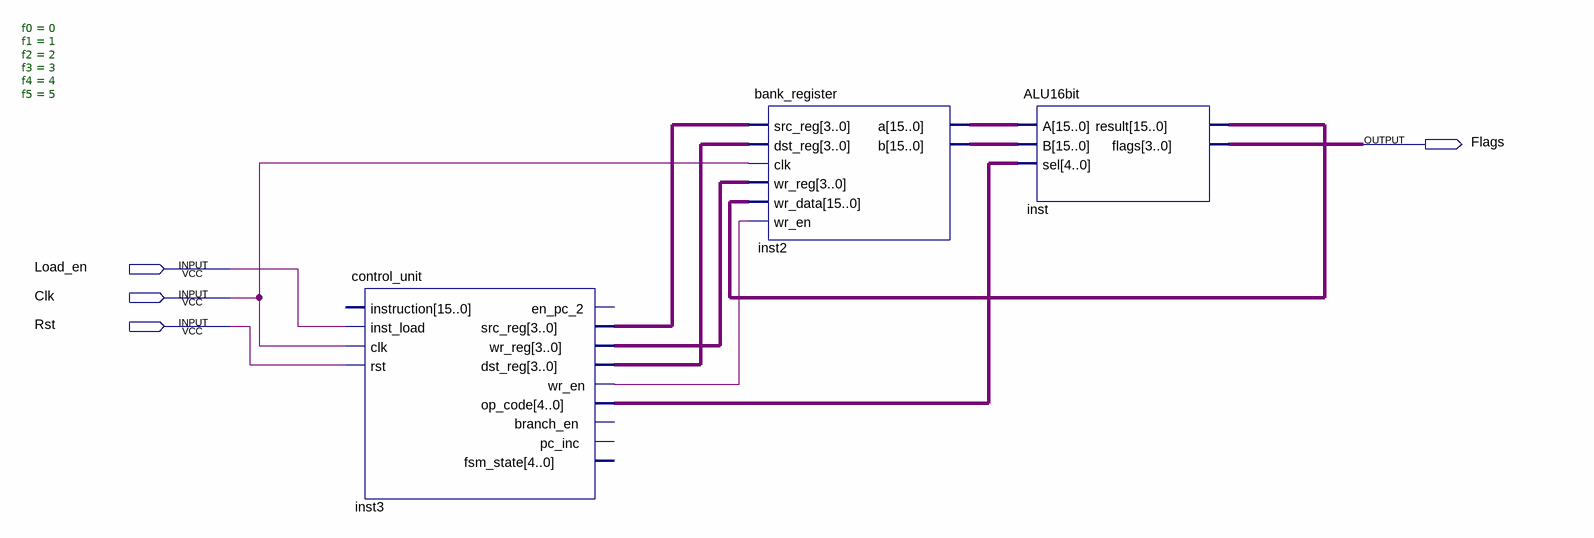
[diagram p0: schematic sheet]
// Quartus schematic MSP430x2xx.bdf as structural Verilog: 3 symbols, 4 pins
module MSP430x2xx (
  input  Load_en,
  input  Clk,
  input  Rst,
  output Flags
);

  wire inst3_wr_en;
  wire [3:0] inst3_dst_reg, inst3_src_reg, inst3_wr_reg, inst_flags;
  wire [4:0] inst3_op_code;
  wire [15:0] inst2_a, inst2_b, inst_result;

  control_unit #(.f0(0), .f1(1), .f2(2), .f3(3), .f4(4), .f5(5)) inst3 (
    .inst_load(Load_en), .clk(Clk), .rst(Rst), .src_reg(inst3_src_reg), .wr_reg(inst3_wr_reg),
    .dst_reg(inst3_dst_reg), .wr_en(inst3_wr_en), .op_code(inst3_op_code));  // open: instruction, en_pc_2, branch_en, pc_inc, fsm_state
  bank_register inst2 (
    .src_reg(inst3_src_reg), .dst_reg(inst3_dst_reg), .clk(Clk), .wr_reg(inst3_wr_reg),
    .wr_data(inst_result), .wr_en(inst3_wr_en), .a(inst2_a), .b(inst2_b));
  ALU16bit inst (.A(inst2_a), .B(inst2_b), .sel(inst3_op_code), .result(inst_result), .flags(inst_flags));
endmodule
